# Altium schematic sheet ClockDiv.SchDoc
size A4
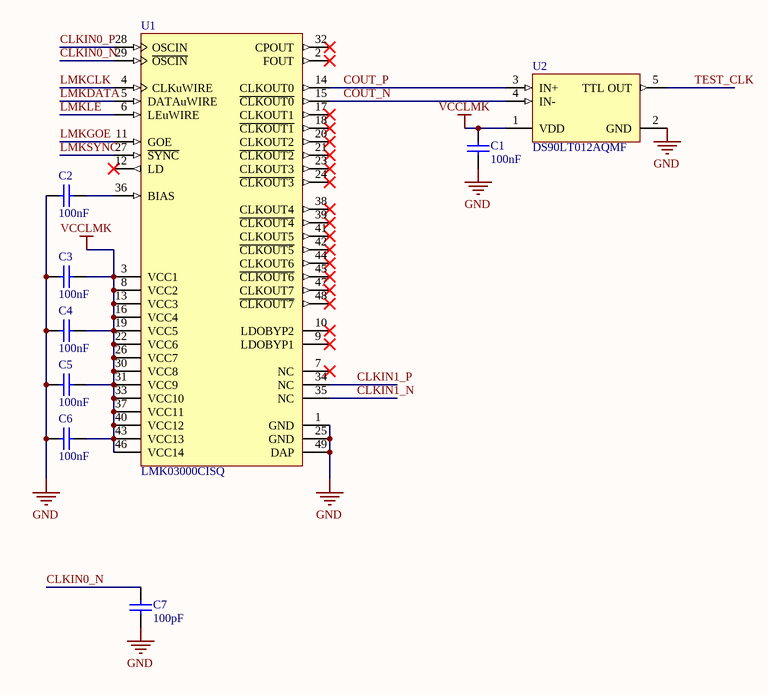
[diagram p0: ClockDiv.SchDoc]

## Parts
C1  100nF  [1608[0603]]
C2  100nF  [1608[0603]]
C3  100nF  [1608[0603]]
C4  100nF  [1608[0603]]
C5  100nF  [1608[0603]]
C6  100nF  [1608[0603]]
C7  100pF  [1608[0603]]
U1  LMK03000CISQ  [SQ48A-04]
U2  DS90LT012AQMF  [MF05A_N]

## Nets
GND: C1.1 C2.1 C3.1 C4.1 C5.1 C6.1 C7.1 U1.1(GND) U1.25(GND) U1.49(DAP) U2.2(GND)
VCCLMK: C1.2 C3.2 C4.2 C5.2 C6.2 U1.3(VCC1) U1.8(VCC2) U1.13(VCC3) U1.16(VCC4) U1.19(VCC5) U1.22(VCC6) U1.26(VCC7) U1.30(VCC8) U1.31(VCC9) U1.33(VCC10) U1.37(VCC11) U1.40(VCC12) U1.43(VCC13) U1.46(VCC14) U2.1(VDD)
CLKIN0_N: C7.2 U1.29(~{OSCIN})
CLKIN0_P: U1.28(OSCIN)
CLKIN1_N: U1.35(NC)
CLKIN1_P: U1.34(NC)
COUT_N: U1.15(~{CLKOUT0}) U2.4(IN-)
COUT_P: U1.14(CLKOUT0) U2.3(IN+)
LMKCLK: U1.4(CLKuWIRE)
LMKDATA: U1.5(DATAuWIRE)
LMKGOE: U1.11(GOE)
LMKLE: U1.6(LEuWIRE)
LMKSYNC: U1.27(~{SYNC})
TEST_CLK: U2.5(TTL_OUT)
NetC2_2: C2.2 U1.36(BIAS)

Not connected (* = marked no-connect by the designer): U1 2(FOUT)* 7(NC)* 9(LDOBYP1)* 10(LDOBYP2)* 12(LD)* 17(CLKOUT1)* 18(~{CLKOUT1})* 20(CLKOUT2)* 21(~{CLKOUT2})* 23(CLKOUT3)* 24(~{CLKOUT3})* 32(CPOUT)* 38(CLKOUT4)* 39(~{CLKOUT4})* 41(CLKOUT5)* 42(~{CLKOUT5})* 44(CLKOUT6)* 45(~{CLKOUT6})* 47(CLKOUT7)* 48(~{CLKOUT7})*

## Library data of the parts
C1-C7 = Cap Semi: Capacitor (Semiconductor SIM Model); Published: 8-Jun-2000; LatestRevisionDate: 29-May-2009; LatestRevisionNote: IPC-7351 Footprint Added.; PackageReference: C1206; Publisher: Altium Limited; PackageDescription: Chip Capacitor
  C1-C6: Value: 100nF
  C7: Value: 100pF
U1 = LMK03001CISQ: Precision Clock Conditioner with Integrated VCO
U2 = DS90LT012AQMF: Automotive LVDS Differential Line Receiver, 5-pin SOT-23; Manufacturer: National Semiconductor; PackageTopMarking: N03Q*XTT; PowerWise: N; CompType: Interface IC; Published: 4-Dec-2008; DatasheetVersion: Oct-2008; PackageVersion: revD, Aug-2008; PackageReference: MF05A; Publisher: Altium Limited; PackageDescription: Molded SOT-23, .115 x .063 x .040 in Body, 5 Lead, .0375 in Pitch; PartNumber: DS90LT012AQMF; RoHS: Y; PinCount: 5; ComponentLink1Description: DS90LT012AQ Datasheet; ComponentLink1URL: http://www.national.com/ds/DS/DS90LT012AQ.pdf; ComponentLink2Description: DS90LT012AQ Web Page; ComponentLink2URL: http://www.national.com/pf/DS/DS90LT012AQ.html; ComponentLink3Description: MF05A Package Page; ComponentLink3URL: http://www.national.com/packaging/folders/mf05a.html